# EAGLE design handheld temp sensor v2 (EAGLE 9.3.0)
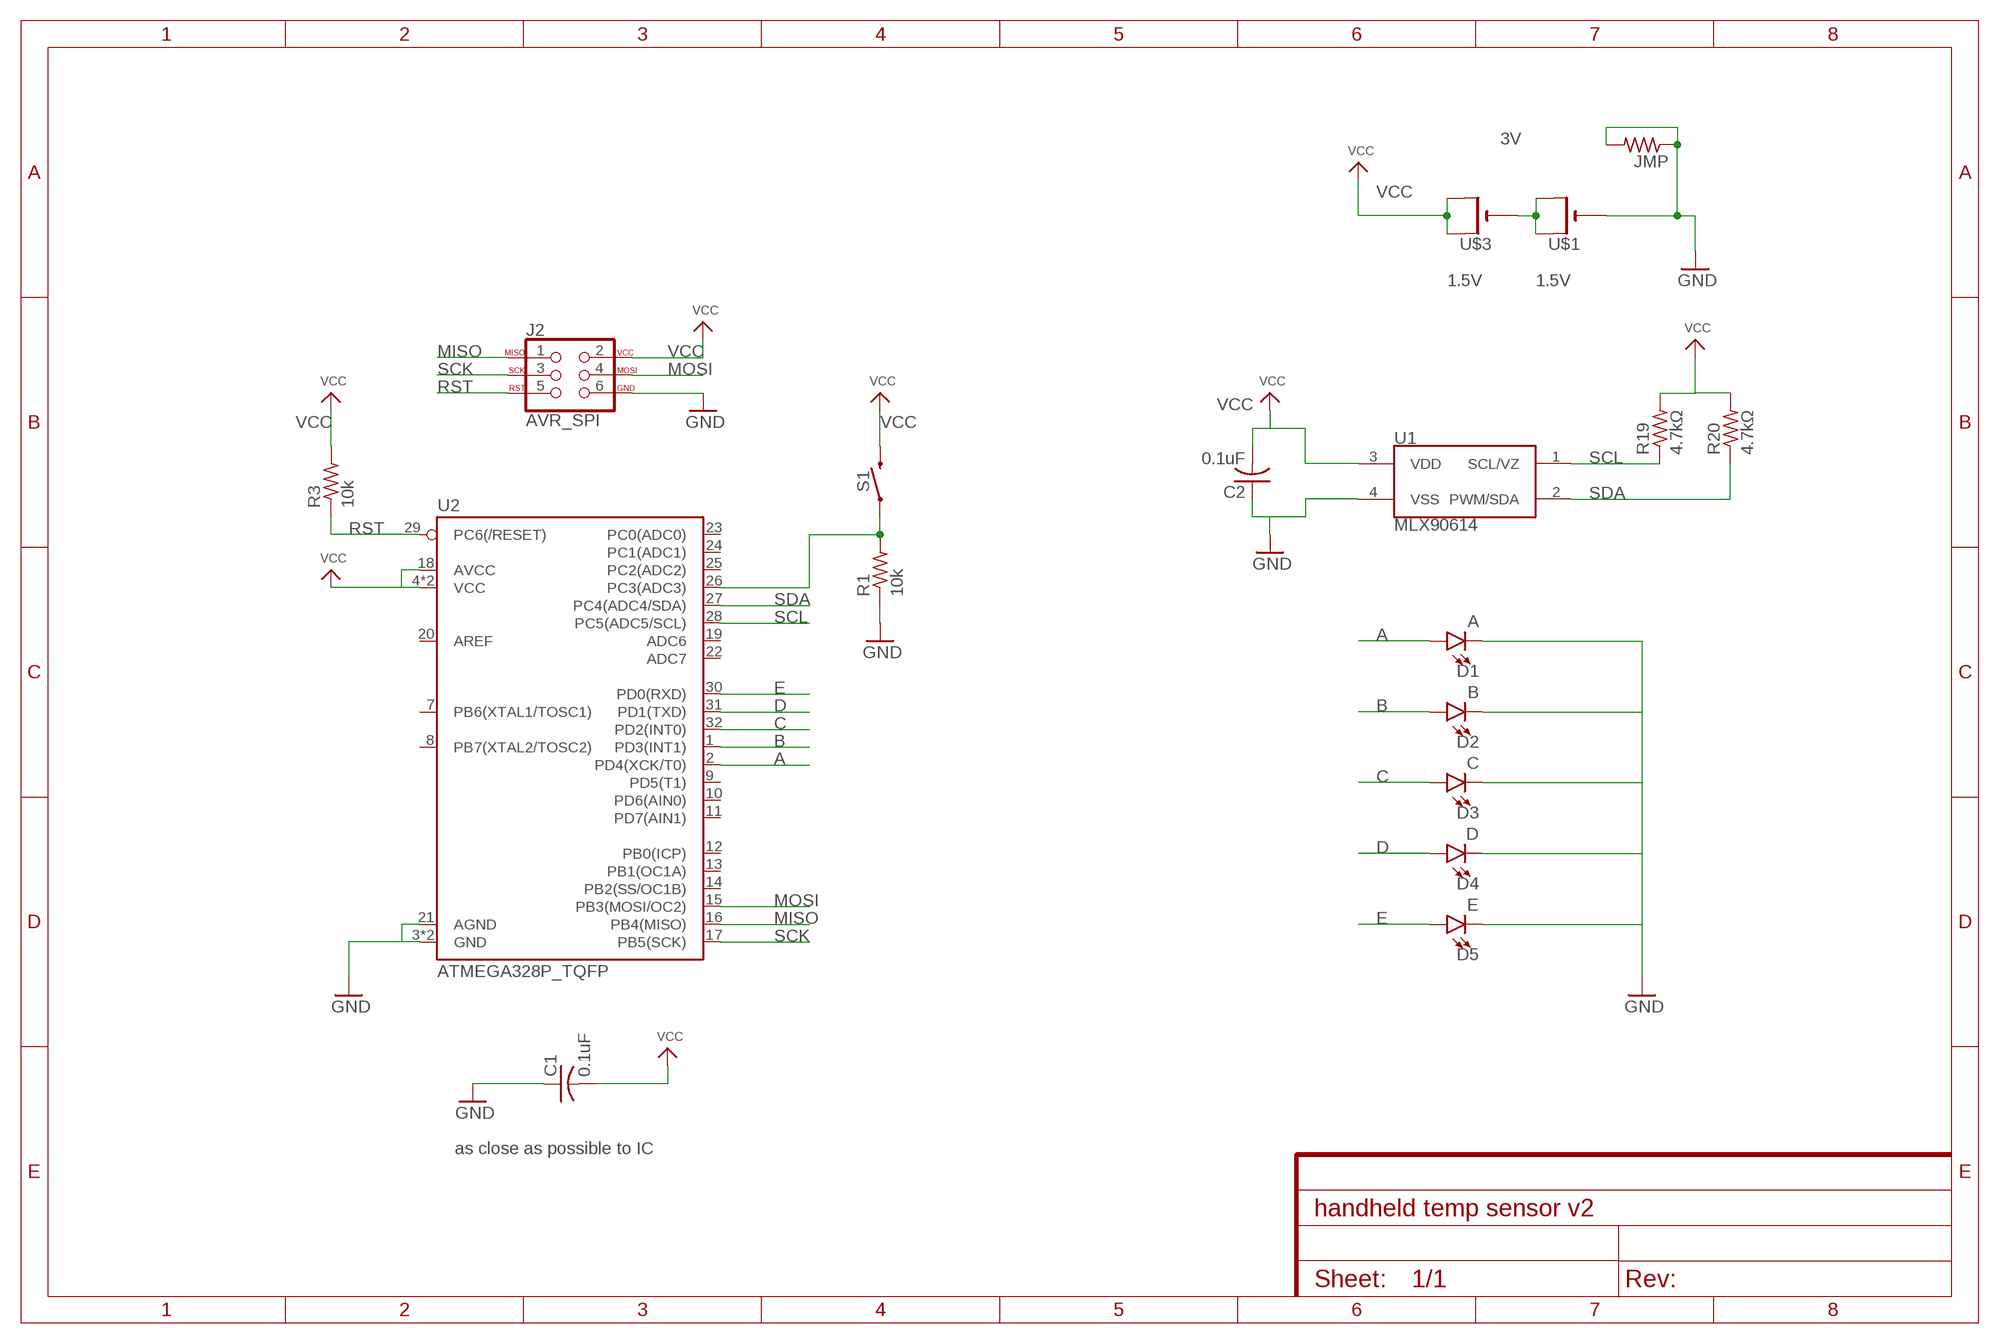
[diagram p0: schematic, sheet 1]

## Parts
C1  0.1uF  C-USC1206  [C1206]
C2  0.1uF  C-USC1206  [C1206]
D1  A  LED-RED1206  [LED-1206]
D2  B  LED-RED1206  [LED-1206]
D3  C  LED-RED1206  [LED-1206]
D4  D  LED-RED1206  [LED-1206]
D5  E  LED-RED1206  [LED-1206]
J2  AVR_SPI  AVR_SPI_PROG_3X2SMD  [2X3_SMT_POSTS]
JMP  R-US_R1206  [R1206]
R1  10k  R-US_R1206  [R1206]
R3  10k  R-US_R1206  [R1206]
R19  4.7kΩ  R-US_R1206  [R1206]
R20  4.7kΩ  R-US_R1206  [R1206]
S1  MOMENTARY-SWITCH-SPST-PTH-6.0MM  [TACTILE_SWITCH_PTH_6.0MM]
U1  MLX90614  [TO-39]
U2  ATMEGA328P_TQFP  [TQFP32-08]
U$1  CR1220THM  [CR1220-THM]
U$3  CR1220THM  [CR1220-THM]

## Nets
A: D1.A U2.2(PD4(XCK/T0))
B: D2.A U2.1(PD3(INT1))
C: D3.A U2.32(PD2(INT0))
D: D4.A U2.31(PD1(TXD))
E: D5.A U2.30(PD0(RXD))
GND: C1.1 C2.1 D1.C D2.C D3.C D4.C D5.C J2.6 JMP.1 JMP.2 R1.1 U1.4(VSS) U2.3(GND) U2.5(GND) U2.21(AGND) U$1.-
MISO: J2.1 U2.16(PB4(MISO))
MOSI: J2.4 U2.15(PB3(MOSI/OC2))
N$1: R1.2 S1.1 U2.26(PC3(ADC3))
N$2: U$1.+1(+) U$1.+2(+1) U$3.-
RST: J2.5 R3.1 U2.29(PC6(/RESET))
SCK: J2.3 U2.17(PB5(SCK))
SCL: R19.1 U1.1(SCL/VZ) U2.28(PC5(ADC5/SCL))
SDA: R20.1 U1.2(PWM/SDA) U2.27(PC4(ADC4/SDA))
VCC: C1.2 C2.2 J2.2 R3.2 R19.2 R20.2 S1.3 U1.3(VDD) U2.4(VCC) U2.6(VCC) U2.18(AVCC) U$3.+1(+) U$3.+2(+1)
Unconnected: U2.7(PB6(XTAL1/TOSC1)) U2.8(PB7(XTAL2/TOSC2)) U2.9(PD5(T1)) U2.10(PD6(AIN0)) U2.11(PD7(AIN1)) U2.12(PB0(ICP)) U2.13(PB1(OC1A)) U2.14(PB2(SS/OC1B)) U2.19(ADC6) U2.20(AREF) U2.22(ADC7) U2.23(PC0(ADC0)) U2.24(PC1(ADC1)) U2.25(PC2(ADC2))

## Notes on the sheet
- 3V
- 1.5V | 1.5V
- as close as possible to IC

## Library data of the parts
C1 C2 = adafruit:C-US: CAPACITOR, American symbol
D1-D5 = SparkFun-LED:LED-RED: Red SMD LED Used in manufacturing of most products at SparkFun Packages: 0603 - SMD 0603 package [Product Link] <http://docs.avagotech.com/docs/AV02-0551EN> 0603 SMART - SMD 0603 SMART package ( more efficient and expensive)[Product Link] <http://www.osram-os.com/Graphics/XPic2/00077099_0.pdf> 1206 - SMD1206 package [Product Link] <https://www.sparkfun.com/datasheets/DevTools/LilyPad/Q150OVS4.pdff> SparkFun Products: Pro Mini 328 -5V <https://www.sparkfun.com/products/821> RedBoard <https://www.sparkfun.com/products/12757> IOIO-OTG <https://www.sparkfun.com/products/13613>; PROD_ID: DIO-09912; VALUE: RED
J2 = SparkFun-Connectors:AVR_SPI_PROG_3X2: AVR ISP 6 Pin This is the reduced ISP connector for AVR programming. Common on Arduino. This footprint will take up less PCB space and can be used with a 10-pin to 6-pin adapter such as SKU: BOB-08508 **Special note about "TEST_POINT" package. The stop mask is on the top side, so if you want your programming test points to be on the bottom of your board, make sure to place this package on the bottom side of the board. This also ensure that the orientation to program from the bottom side will be correct. SparkFun Products: SparkFun ISP Pogo Adapter <https://www.sparkfun.com/products/11591> - NS Tiny AVR Programmer <https://www.sparkfun.com/products/11801> -PTH
JMP R1 R3 R19 R20 = adafruit:R-US_: RESISTOR, American symbol
S1 = SparkFun-Switches:MOMENTARY-SWITCH-SPST: Momentary Switch (Pushbutton) - SPST Normally-open (NO) SPST momentary switches (buttons, pushbuttons). Variants PTH-12MM - 12mm square, through-hole Momentary Pushbutton Switch - 12mm Square <https://www.sparkfun.com/products/9190> (COM-09190) PTH-6.0MM, PTH-6.0MM-KIT - 6.0mm square, through-hole Mini Pushbutton Switch <https://www.sparkfun.com/products/97> (COM-00097) KIT package intended for soldering kit's - only one side of pads' copper is exposed. PTH-RIGHT-ANGLE-KIT - Right-angle, through-hole Right Angle Tactile Button <https://www.sparkfun.com/products/10791> - Used on SparkFun BigTime Watch Kit <https://www.sparkfun.com/products/11734> SMD-12MM - 12mm square, surface-mount Tactile Button - SMD (12mm) <https://www.sparkfun.com/products/12993> (COM-12993) Used on SparkFun PicoBoard <https://www.sparkfun.com/products/11888> SMD-4.5MM - 4.5mm Square Trackball Switch Used on SparkFun Blackberry Trackballer Breakout <https://www.sparkfun.com/products/13169> SMD-4.6MMX2.8MM - 4.60mm x 2.80mm, surface mount Used on SparkFun SAMD21 Mini Breakout <https://www.sparkfun.com/products/13664> SMD-5.2MM, SMD-5.2-REDUNDANT - 5.2mm square, surface-mount Mini Pushbutton Switch - SMD <https://www.sparkfun.com/products/8720> (COM-08720) Used on Arduino Pro Mini <https://www.sparkfun.com/products/11114> REDUNDANT package connects both switch circuits together SMD-6.0X3.5MM - 6.0 x 3.5mm, surface mount Momentary Reset Switch SMD <https://www.sparkfun.com/products/8229> (COM-08229) SMD-6.2MM-TALL - 6.2mm square, surface mount Tactile Button - SMD (6mm) <https://www.sparkfun.com/products/12992> Used on SparkFun Digital Sandbox <https://www.sparkfun.com/products/12651> SMD-RIGHT-ANGLE - Right-angle, surface mount Used on SparkFun Block for Intel® Edison - Arduino <https://www.sparkfun.com/products/13036>; PROD_ID: SWCH-08441; SF_SKU: COM-00097
U1 = SparkFun-Sensors:MLX90614: Melexis MLX90614 Infrared (IR) Thermometer The MLX90614 is a passive infrared (PIR) I2C temperature sensor.It is designed for non-contact temperature sensing. An internal 17-bit ADC and a powerful DSP contribute to the MLX90614’s high accuracy and resolution. It has a huge number of applications including body temperature measurment and movement detection. Datasheet <http://www.sparkfun.com/datasheets/Sensors/Temperature/SEN-09570-datasheet-3901090614M005.pdf> SparkFun Products Infrared Thermometer - MLX90614 <https://www.sparkfun.com/products/9570> (SEN-09570) SparkFun IR Thermometer Evaluation Board - MLX90614 <https://www.sparkfun.com/products/10740> (SEN-10740); PROD_ID: COMP-09719; SF_ID: SEN-09570
U2 = SparkFun-IC-Microcontroller:ATMEGA328P_TQFP: Popular 328P in QFP Storefront component: ATmega328 - TQFP <https://www.sparkfun.com/products/13448> (COM-13448) Datasheet <http://www.sparkfun.com/datasheets/Components/SMD/ATMega328.pdf> SparkFun Products SparkFun RedBoard - Programmed with Arduino <https://www.sparkfun.com/products/12757> (DEV-12757) Arduino Pro Mini 328 - 5V/16MHz <https://www.sparkfun.com/products/11113> (DEV-11113) Arduino Pro Mini 328 - 3.3V/8MHz <https://www.sparkfun.com/products/11114> (DEV-11114) SparkFun OpenLog <https://www.sparkfun.com/products/13712> (DEV-13712) SparkFun MicroView - OLED Arduino Module <https://www.sparkfun.com/products/12923> (DEV-12923) SparkFun Digital Sandbox <https://www.sparkfun.com/products/12651> (DEV-12651) SparkFun PicoBoard <https://www.sparkfun.com/products/11888> (WIG-11888) Arduino Fio <https://www.sparkfun.com/products/10116> (DEV-10116) LilyPad Arduino 328 Main Board <https://www.sparkfun.com/products/13342> (DEV-13342) SparkFun RedStick <https://www.sparkfun.com/products/13741> (DEV-13741) LilyPad MP3 <https://www.sparkfun.com/products/11013> (DEV-11013) LilyPad Arduino SimpleSnap <https://www.sparkfun.com/products/10941> (DEV-10941) SparkFun Stepoko <https://www.sparkfun.com/products/13899> (ROB-13899) SparkFun Geiger Counter <https://www.sparkfun.com/products/11345> (SEN-11345) SparkFun EL Sequencer <https://www.sparkfun.com/products/12781> (COM-12781) Arduino Pro 328 - 5V/16MHz <https://www.sparkfun.com/products/10915> (DEV-10915) CryptoCape <https://www.sparkfun.com/products/12773> (DEV-12773) SparkFun IR Thermometer Evaluation Board - MLX90614 <https://www.sparkfun.com/products/10740> (SEN-10740) SparkFun RedBot Mainboard <https://www.sparkfun.com/products/12097> (ROB-12097) Arduino Pro 328 - 3.3V/8MHz <https://www.sparkfun.com/products/10914> (DEV-10914) SparkFun Block for Intel® Edison - Arduino <https://www.sparkfun.com/products/13036> (DEV-13036) SparkFun Simon Says - Surface Mount Soldering Kit <https://www.sparkfun.com/products/10935> (KIT-10935) SparkFun 7-Segment Serial Display - Red <https://www.sparkfun.com/products/11441> (COM-11441) SparkFun 7-Segment Serial Display - White <https://www.sparkfun.com/products/11629> (COM-11629) SparkFun 7-Segment Serial Display - Yellow <https://www.sparkfun.com/products/11443> (COM-11443) SparkFun 7-Segment Serial Display - Kelly Green <https://www.sparkfun.com/products/11440> (COM-11440) SparkFun 7-Segment Serial Display - Blue <https://www.sparkfun.com/products/11442> (COM-11442) SparkFun OpenSegment Serial Display - 20mm (Blue) <https://www.sparkfun.com/products/11647> (COM-11647) SparkFun OpenSegment Serial Display - 20mm (Green) <https://www.sparkfun.com/products/11646> (COM-11646) SparkFun OpenSegment Serial Display - 20mm (White) <https://www.sparkfun.com/products/11648> (COM-11648) SparkFun OpenSegment Serial Display - 20mm (Red) <https://www.sparkfun.com/products/11644> (COM-11644) SparkFun OpenSegment Serial Display - 20mm (Yellow) <https://www.sparkfun.com/products/11645> (COM-11645) SparkFun OpenSegment Shield <https://www.sparkfun.com/products/13190> (DEV-13190); PROD_ID: IC-09069
U$1 U$3 = adafruit:CR1220: CR1216/CR1220/CR1225 12mm 3V lithium coin cell Great for battery packup. Both SMT and THM holders. Note the THM package has the ground pads on both sides of the PCB so that the masks are the same - this reduces the cost

## Board
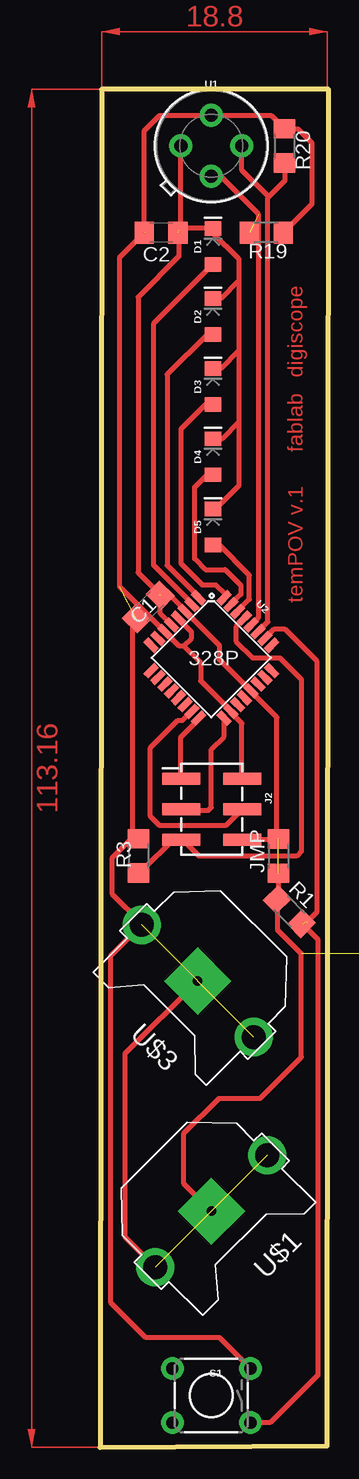
[diagram p1: board, top side]

Size 19.05 x 113.16 mm. Coordinates in mm from the lower left corner, seen from the top.
Outline: 0,0 18.92,0.13 19.05,113.16 0.13,113.16 0,0
Copper layers (1*16): Top 0.035mm / dielectric 1.5mm / Bottom 0.035mm
Design rules "adafruit *": minimum track width 16mil, minimum drill 1mm, track to track 0.1mm, track to pad 0.1mm, pad to pad 0.1mm, via to via 0.1mm, smd to smd 0.1mm, copper to edge 0.1mm, drill to drill 1mm, minimum pad ring 10mil, minimum via ring 8mil, stop-mask expansion 2mil, vias tented up to drill 20mil, thermal gap 10mil

### Footprints (pad centres in the part's own frame; a part is rotated, then mirrored left to right if it is on the bottom)
C1206 = smd 1.6 x 1.8: 1 -1.4,0; 2 1.4,0
LED-1206 = smd 1.2 x 1.4: A -1.5,0; C 1.5,0
2X3_SMT_POSTS = smd 1 x 3.17: 1 -2.54,-2.54; 2 -2.54,2.54; 3 0,-2.54; 4 0,2.54; 5 2.54,-2.54; 6 2.54,2.54
R1206 = smd 1.6 x 1.803: 1 -1.422,0; 2 1.422,0
TACTILE_SWITCH_PTH_6.0MM = drill 1.016 pad 1.88: 1 -3.251,2.261; 2 3.251,2.261; 3 -3.251,-2.261; 4 3.251,-2.261
TO-39 = drill 1.1 pad 1.93: 1 2.54,0; 2 0,2.54; 3 -2.54,0; 4 0,-2.54
TQFP32-08 = smd 1.27 x 0.559: 1 -4.293,2.8; 2 -4.293,2; 3 -4.293,1.2; 4 -4.293,0.4; 5 -4.293,-0.4; 6 -4.293,-1.2; 7 -4.293,-2; 8 -4.293,-2.8; 17 4.293,-2.8; 18 4.293,-2; 19 4.293,-1.2; 20 4.293,-0.4; 21 4.293,0.4; 22 4.293,1.2; 23 4.293,2; 24 4.293,2.8 | smd 0.559 x 1.27: 9 -2.8,-4.293; 10 -2,-4.293; 11 -1.2,-4.293; 12 -0.4,-4.293; 13 0.4,-4.293; 14 1.2,-4.293; 15 2,-4.293; 16 2.8,-4.293; 25 2.8,4.293; 26 2,4.293; 27 1.2,4.293; 28 0.4,4.293; 29 -0.4,4.293; 30 -1.2,4.293; 31 -2,4.293; 32 -2.8,4.293
CR1220-THM = drill 2 pad 3.175: +1 -6.604,0; +2 6.604,0 | drill 0.8 pad 3.962 square: - 0,0

### Placement (x,y rotation side)
C1  4.01,70.03 225 top
C2  5.08,101.22 180 top
D1  9.4,100.08 90 top
D2  9.4,94.23 90 top
D3  9.4,88.39 90 top
D4  9.4,82.55 90 top
D5  9.4,76.71 90 top
J2  9.29,53.18 270 top
JMP  14.86,49.28 90 top
R1  15.77,44.65 315 top
R3  3.19,49.29 90 top
R19  13.84,101.22 0 top
R20  15.37,108.46 90 top
S1  9.27,4.32 180 top
U1  9.27,108.46 270 top
U2  9.27,65.79 315 top
U$1  9.27,19.69 225 top
U$3  8.13,38.86 135 top

### Tracks (layer width: path | path; a pad name or v marks a point on that pad's centre or on a via)
A
  Top 0.406: D1.A 4.44,93.62 4.44,73.53 7.65,70.33 U2.2
B
  Top 0.406: D2.A 8.91,92.73 5.59,89.41 5.59,73.51 8.22,70.88 U2.1
C
  Top 0.406: D3.A 8.76,86.89 6.73,84.86 6.73,73.66 8.51,71.88 9.65,71.88 10.45,71.08 10.45,70.93 U2.32
D
  Top 0.406: U2.31 11.73,71.07 11.73,71.84 10.41,73.15 8.76,73.15 7.87,74.04 7.87,80.01 8.91,81.05 D4.A
E
  Top 0.406: 11.46,69.75 U2.30 12.45,70.66 12.45,72.67 9.91,75.21 D5.A
GND  (via drill 0.5)  (8 unrouted)
  Top 0.406: 11.56,97.26 11.56,99.04 9.4,101.19 D1.C 6.73,101.58 6.68,101.52 | 11.56,97.26 11.56,91.42 | 11.56,91.42 11.56,85.45 | 11.56,85.45 11.56,80.14 9.63,78.21 D5.C | 11.56,85.45 10.16,84.05 D4.C | 11.56,91.42 10.03,89.89 D3.C | 11.56,97.26 10.03,95.73 D2.C | 6.68,101.52 6.55,101.4 6.55,99.24 3.17,95.86 3.17,72.9 5.02,71.06 | U2.5 5.02,69.47 5.02,71.06 | 5.02,71.06 5.02,71.82 7.08,69.75 U2.3 9.91,66.85 9.91,65.66 12.53,63.03 U2.21 12.59,62.98 14.73,60.83 14.73,51.05 14.62,50.94 | J2.6 11.86,50.67 14.35,50.67 14.62,50.94 | U1.4 6.68,108.41 6.68,101.52 | JMP.2 14.62,50.94 | 14.86,47.22 JMP.1 14.86,45.66 R1.1 14.76,43.15 16.76,41.15 16.76,32.51 13.34,29.08 9.91,29.08 6.98,26.16 6.98,21.97 U$1.-
  other vias: 61.66,37.91 72.52,12.83 74.55,9.27 27.94,41.15 74.55,12.83
MISO
  Top 0.406: J2.1 6.73,55.73 6.73,59.18 8.22,60.67 U2.16
MOSI
  Top 0.406: J2.4 10.47,51.82 4.95,51.82 4.19,52.58 4.19,58.29 6.48,60.58 6.86,60.58 7.62,61.34 U2.15
N$1  (1 unrouted)
  Top 0.406: U2.26 14.51,68.2 15.37,68.2 18.03,65.53 18.03,44.58 17.24,43.79 | S1.1 14.17,2.06 18.16,6.04 18.16,42.32 16.83,43.65 R1.2
N$2  (1 unrouted)
  Top 0.406: U$1.+2 2.06,17.55 2.06,32.8 U$3.-
RST
  Top 0.406: U2.29 11.3,68.38 11.3,67.18 12.7,65.79 14.99,65.79 16.76,64.01 16.76,49.66 16.38,49.28 8.26,49.28 6.89,50.64 J2.5 6.9,50.79 6.24,50.79 3.32,47.87 R3.1
SCK
  Top 0.406: J2.3 6.84,53.09 9.02,53.09 9.27,53.34 9.27,58.17 10.33,59.22 U2.17
SCL  (1 unrouted)
  Top 0.406: U2.28 13.21,69.16 13.21,102.74 10.03,105.92 U1.1
SDA
  Top 0.406: U2.27 13.97,68.79 13.97,104.14 14.03,104.2 | 14.03,104.2 11.81,106.43 U1.2 | R20.1 15.37,105.54 14.03,104.2
VCC  (3 unrouted)
  Top 0.406: 6.98,66.8 6.56,66.8 U2.6 1.65,71.71 1.65,99.19 C2.2 3.68,109.73 4.95,111 U1.3 14.25,111 R20.2 16.48,109.88 17.65,108.71 17.65,103.61 R19.2 | 6.98,66.8 7.62,67.44 7.62,67.94 6.52,69.05 U2.4 | 6.98,66.8 8.38,65.41 8.38,63.88 10.89,61.37 U2.18 10.89,61.24 11.81,60.33 11.81,55.73 J2.2 | C1.2 2.68,68.7 2.68,51.22 R3.2 2.58,50.71 1.02,49.15 1.02,46.1 3.46,43.66 U$3.+2 0.89,40.96 0.89,12.06 3.81,9.14 9.96,9.14 S1.3
(copper drawn outside any net)
  shapes: Top area x2

### Text on the board
Top: digiscope | fablab | temPOV v.1
tPlace: 328P